# Altium project Closed_Loop_Sensor.PrjPcb
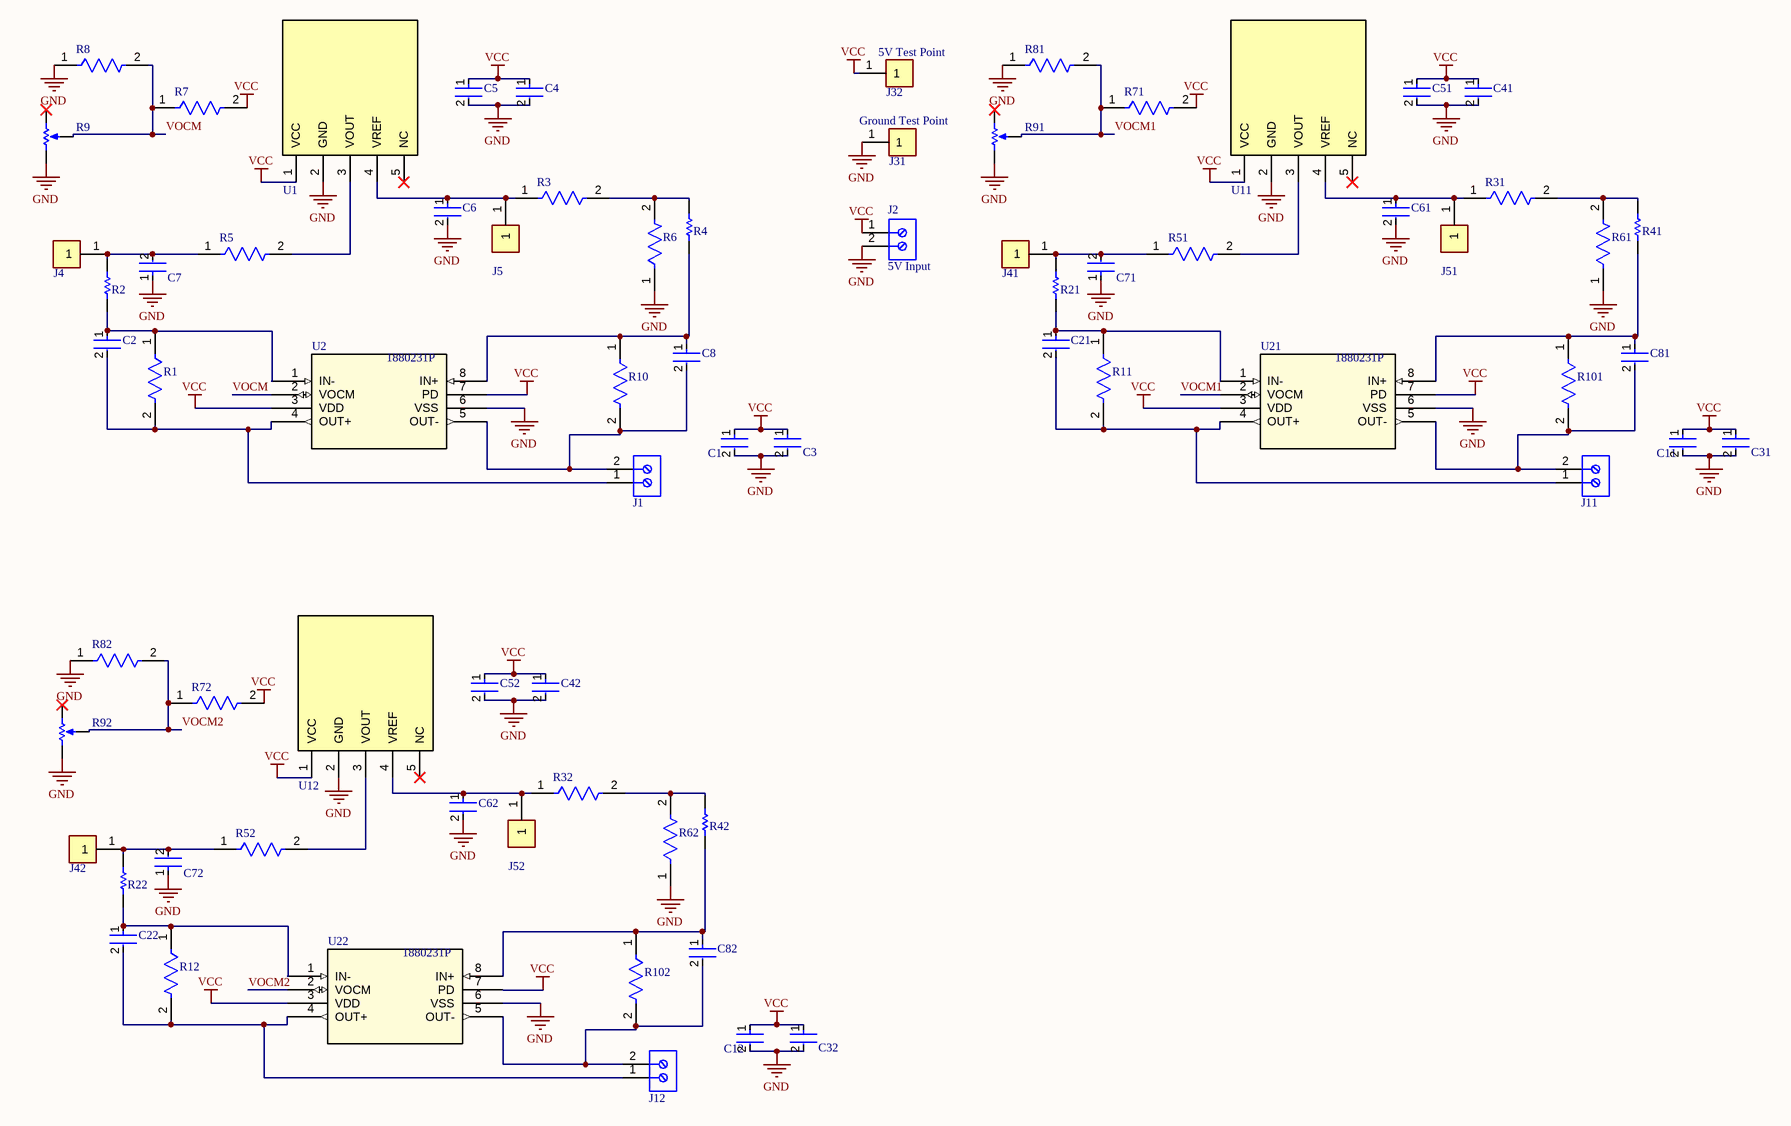
[diagram p0: Sensor.SchDoc]
1 sheet, 72 parts. Net scope: global (net labels, ports and power ports of the same name join across sheets).
Board file: Sensor.PcbDoc

## Sheet Sensor.SchDoc: Closed Loop Sensor
size 420 x 297 mm; ENG_APP_DATE: --/--/--; DSN_APP_DATE: --/--/--; CHK_APP_DATE: --/--/--; DrawnBy: João Chaves; DocumentNumber: 1; SheetNumber: 1; SheetTotal: 1

### Parts
C1  0805YC105KAT2A  [FP-0805-L_2_01_0_2-W_1_25-IPC_A]  (value not drawn)
C2  06035A100JAT2A  [FP-0603-L_1_6_0_15-W_0_81-MFG]  (value not drawn)
C3  CL21B104KACNNNC  [FP-CL21-IPC_C]  (value not drawn)
C4  CL21A106KPFNNNG  [FP-CL21-IPC_B]  (value not drawn)
C5  CL21B104KACNNNC  [FP-CL21-IPC_C]  (value not drawn)
C6  CL21B104KACNNNC  [FP-CL21-IPC_C]  (value not drawn)
C7  06035A100JAT2A  [FP-0603-L_1_6_0_15-W_0_81-MFG]  (value not drawn)
C8  06035A100JAT2A  [FP-0603-L_1_6_0_15-W_0_81-MFG]  (value not drawn)
C11  0805YC105KAT2A  [FP-0805-L_2_01_0_2-W_1_25-IPC_A]  (value not drawn)
C12  0805YC105KAT2A  [FP-0805-L_2_01_0_2-W_1_25-IPC_A]  (value not drawn)
C21  06035A100JAT2A  [FP-0603-L_1_6_0_15-W_0_81-MFG]  (value not drawn)
C22  06035A100JAT2A  [FP-0603-L_1_6_0_15-W_0_81-MFG]  (value not drawn)
C31  CL21B104KACNNNC  [FP-CL21-IPC_C]  (value not drawn)
C32  CL21B104KACNNNC  [FP-CL21-IPC_C]  (value not drawn)
C41  CL21A106KPFNNNG  [FP-CL21-IPC_B]  (value not drawn)
C42  CL21A106KPFNNNG  [FP-CL21-IPC_B]  (value not drawn)
C51  CL21B104KACNNNC  [FP-CL21-IPC_C]  (value not drawn)
C52  CL21B104KACNNNC  [FP-CL21-IPC_C]  (value not drawn)
C61  CL21B104KACNNNC  [FP-CL21-IPC_C]  (value not drawn)
C62  CL21B104KACNNNC  [FP-CL21-IPC_C]  (value not drawn)
C71  06035A100JAT2A  [FP-0603-L_1_6_0_15-W_0_81-MFG]  (value not drawn)
C72  06035A100JAT2A  [FP-0603-L_1_6_0_15-W_0_81-MFG]  (value not drawn)
C81  06035A100JAT2A  [FP-0603-L_1_6_0_15-W_0_81-MFG]  (value not drawn)
C82  06035A100JAT2A  [FP-0603-L_1_6_0_15-W_0_81-MFG]  (value not drawn)
J1  691213510002  [691213510002]  (value not drawn)
J2  5V Input  [691213510002]
J4  5001  [FP-5001-MFG]  (value not drawn)
J5  5001  [FP-5001-MFG]  (value not drawn)
J11  691213510002  [691213510002]  (value not drawn)
J12  691213510002  [691213510002]  (value not drawn)
J31  Ground Test Point  [FP-5001-MFG]
J32  5V Test Point  [FP-5001-MFG]
J41  5001  [FP-5001-MFG]  (value not drawn)
J42  5001  [FP-5001-MFG]  (value not drawn)
J51  5001  [FP-5001-MFG]  (value not drawn)
J52  5001  [FP-5001-MFG]  (value not drawn)
R1  RNCP0805FTD1K00  [FP-RNCP0805-MFG]  (value not drawn)
R2  RK73H2ATTD1331F  [RESC2013X60X30NL20T20]  (value not drawn)
R3  RMCF0805ZT0R00  [FP-RMCF0805-MFG]  (value not drawn)
R4  RK73H2ATTD1331F  [RESC2013X60X30NL20T20]  (value not drawn)
R5  RMCF0805ZT0R00  [FP-RMCF0805-MFG]  (value not drawn)
R6  RMCF0805ZT0R00  [FP-RMCF0805-MFG]  (value not drawn)
R7  RT0805DRE0710KL  [FP-RT0805-MFG]  (value not drawn)
R8  RMCF0805ZT0R00  [FP-RMCF0805-MFG]  (value not drawn)
R9  3296W-1-103LF  [BOUR-3296W]  (value not drawn)
R10  RNCP0805FTD1K00  [FP-RNCP0805-MFG]  (value not drawn)
R11  RNCP0805FTD1K00  [FP-RNCP0805-MFG]  (value not drawn)
R12  RNCP0805FTD1K00  [FP-RNCP0805-MFG]  (value not drawn)
R21  RK73H2ATTD1331F  [RESC2013X60X30NL20T20]  (value not drawn)
R22  RK73H2ATTD1331F  [RESC2013X60X30NL20T20]  (value not drawn)
R31  RMCF0805ZT0R00  [FP-RMCF0805-MFG]  (value not drawn)
R32  RMCF0805ZT0R00  [FP-RMCF0805-MFG]  (value not drawn)
R41  RK73H2ATTD1331F  [RESC2013X60X30NL20T20]  (value not drawn)
R42  RK73H2ATTD1331F  [RESC2013X60X30NL20T20]  (value not drawn)
R51  RMCF0805ZT0R00  [FP-RMCF0805-MFG]  (value not drawn)
R52  RMCF0805ZT0R00  [FP-RMCF0805-MFG]  (value not drawn)
R61  RMCF0805ZT0R00  [FP-RMCF0805-MFG]  (value not drawn)
R62  RMCF0805ZT0R00  [FP-RMCF0805-MFG]  (value not drawn)
R71  RT0805DRE0710KL  [FP-RT0805-MFG]  (value not drawn)
R72  RT0805DRE0710KL  [FP-RT0805-MFG]  (value not drawn)
R81  RMCF0805ZT0R00  [FP-RMCF0805-MFG]  (value not drawn)
R82  RMCF0805ZT0R00  [FP-RMCF0805-MFG]  (value not drawn)
R91  3296W-1-103LF  [BOUR-3296W]  (value not drawn)
R92  3296W-1-103LF  [BOUR-3296W]  (value not drawn)
R101  RNCP0805FTD1K00  [FP-RNCP0805-MFG]  (value not drawn)
R102  RNCP0805FTD1K00  [FP-RNCP0805-MFG]  (value not drawn)
U1  STB-LA/Z  [STB_pad_SMT]  (value not drawn)
U2  Supplier Part Number 1: 1880231P  [MSOP8_MS_MCH]  (hidden comment: MCP6D11-E/MS)
U11  STB-LA/Z  [STB_pad_SMT]  (value not drawn)
U12  STB-LA/Z  [STB_pad_SMT]  (value not drawn)
U21  Supplier Part Number 1: 1880231P  [MSOP8_MS_MCH]  (hidden comment: MCP6D11-E/MS)
U22  Supplier Part Number 1: 1880231P  [MSOP8_MS_MCH]  (hidden comment: MCP6D11-E/MS)

### Nets
GND: C1.2 C3.2 C4.2 C5.2 C6.2 C7.1 C11.2 C12.2 C31.2 C32.2 C41.2 C42.2 C51.2 C52.2 C61.2 C62.2 C71.1 C72.1 J2.2 J31.1 R6.1 R8.1 R9.1(CCW) R61.1 R62.1 R81.1 R82.1 R91.1(CCW) R92.1(CCW) U1.2(GND) U2.6(VSS) U11.2(GND) U12.2(GND) U21.6(VSS) U22.6(VSS)
VCC: C1.1 C3.1 C4.1 C5.1 C11.1 C12.1 C31.1 C32.1 C41.1 C42.1 C51.1 C52.1 J2.1 J32.1 R7.2 R71.2 R72.2 U1.1(VCC) U2.3(VDD) U2.7(PD) U11.1(VCC) U12.1(VCC) U21.3(VDD) U21.7(PD) U22.3(VDD) U22.7(PD)
VOCM: R7.1 R8.2 R9.2(S) U2.2(VOCM)
VOCM1: R71.1 R81.2 R91.2(S) U21.2(VOCM)
VOCM2: R72.1 R82.2 R92.2(S) U22.2(VOCM)
NetC2_1: C2.1 R1.1 R2.1 U2.1(IN-)
NetC2_2: C2.2 J1.1 R1.2 U2.4(OUT+)
NetC6_1: C6.1 J5.1 R3.1 U1.4(VREF)
NetC7_2: C7.2 J4.1 R2.2 R5.1
NetC8_1: C8.1 R4.1 R10.1 U2.8(IN+)
NetC8_2: C8.2 J1.2 R10.2 U2.5(OUT-)
NetC21_1: C21.1 R11.1 R21.1 U21.1(IN-)
NetC21_2: C21.2 J11.1 R11.2 U21.4(OUT+)
NetC22_1: C22.1 R12.1 R22.1 U22.1(IN-)
NetC22_2: C22.2 J12.1 R12.2 U22.4(OUT+)
NetC61_1: C61.1 J51.1 R31.1 U11.4(VREF)
NetC62_1: C62.1 J52.1 R32.1 U12.4(VREF)
NetC71_2: C71.2 J41.1 R21.2 R51.1
NetC72_2: C72.2 J42.1 R22.2 R52.1
NetC81_1: C81.1 R41.1 R101.1 U21.8(IN+)
NetC81_2: C81.2 J11.2 R101.2 U21.5(OUT-)
NetC82_1: C82.1 R42.1 R102.1 U22.8(IN+)
NetC82_2: C82.2 J12.2 R102.2 U22.5(OUT-)
NetR3_2: R3.2 R4.2 R6.2
NetR5_2: R5.2 U1.3(VOUT)
NetR31_2: R31.2 R41.2 R61.2
NetR32_2: R32.2 R42.2 R62.2
NetR51_2: R51.2 U11.3(VOUT)
NetR52_2: R52.2 U12.3(VOUT)

Not connected (* = marked no-connect by the designer): R9 3(CW)*; R91 3(CW)*; R92 3(CW)*; U1 5(NC)*; U11 5(NC)*; U12 5(NC)*

### Notes on the sheet
- THIS DOCUMENT AND THE DATA DISCLOSED HEREIN OR
- HEREWITH IS THE PROPERTY OF ALTIUM LIMITED AND MAY
- DWG NO:
- REVISION
- REV:
- DESCRIPTION
- DATE
- APPROVED
- BE FREELY DISTRIBUTED IN WHOLE. NO RIGHTS ARE
- RESERVED OR EXPRESS OR IMPLIED WARANTEE GIVEN.
- ENG:
- APPROVALS
- PROJECT
- DSN:
- CHK:
- REFERENCE DOCUMENTS
- PROJECT REVISION:
- TITLE
- DOCUMENT REVISION:
- DESIGN ITEM:
- BOM:
- FAB DWG:
- PCB DWG:
- ASSY DWG:
- SCALE:
- A3
- SIZE
- CAGE CODE
- FILE NAME
- DWG NO.
- SHEET
- OF
- REV

### Library data of the parts
C1 C11 C12 = CMP-2007-04655-2: General Purpose Ceramic Capacitor, 0805, 1uF, 10%, X7R, 15%, 16V; Dissipation Factor: 3.5%; Case/Package: 0805; Dielectric Material: Ceramic; Number of Pins: 2; Length: 2.01mm; Tolerance: 10%; Capacitance: 1uF; Depth: 1.25mm; Termination: SMD/SMT; Height: 1.4mm; Packaging: Tape and Reel; Max Operating Temperature: 125°C; Case Code (Imperial): 0805; Lead Free: Lead Free; Package Quantity: 1; Construction: Flat; Voltage Rating (DC): 16V; Radiation Hardening: No; Contact Plating: Tin; Thickness: 0.055inch; Dielectric: X7R; Width: 0.049inch; Voltage: 16V; Voltage Rating: 16V; Mount: Surface Mount; Series: -; Min Operating Temperature: -55°C; REACH SVHC: No SVHC; RoHS Compliant: Yes; Case Code (Metric): 2012
C2 C7 C8 C21 C22 C71 C72 C81 C82 = CMP-2006-04215-2: General Purpose Ceramic Capacitor, 0603, 10pF, 5%, NP0, 30ppm/°C, 50V; Dielectric: C0G; Insulation Resistance: 100GR; Temperature Coefficient: 30ppm/°C; Case/Package: 0603; Tolerance: 5%; Radiation Hardening: No; Contact Plating: Tin; Dielectric Material: Ceramic; Thickness: 0.035inch; Capacitance: 10pF; Depth: 0.81mm; Min Operating Temperature: -55°C; Case Code (Metric): 1608; Max Operating Temperature: 125°C; Package Quantity: 1; Lead Free: Lead Free; Case Code (Imperial): 0603; Termination: SMD/SMT; Voltage Rating (DC): 50V; RoHS Compliant: Yes; REACH SVHC: No SVHC; Width: 0.032inch; Number of Pins: 2; Packaging: Tape and Reel; Height: 0.63mm; Voltage Rating: 50V; Mount: Surface Mount; Length: 1.6mm; Voltage: 50V
C3 C5 C6 C31 C32 C51 C52 C61 C62 = CMP-13271-002854-1: CL21 Series 0805 100nF 25V ±10% Tolerance X7R Multilayer Ceramic Chip Capacitor; Thickness: 0.037inch; Dielectric: X7R; Packaging: Tape and Reel; Height: 0.85mm; Case/Package: 0805; Mount: Surface Mount; Case Code (Imperial): 0805; Capacitance: 100nF; Case Code (Metric): 2012; Length: 2mm; Voltage Rating: 25V; Voltage: 25V; Contact Plating: Tin; Tolerance: 10%; Max Operating Temperature: 125°C; Width: 0.049inch; Min Operating Temperature: -55°C; Radiation Hardening: No; Package Quantity: 1; Depth: 1.25mm
C4 C41 C42 = CMP-13271-001796-1: CL21 Series 0805 10uF 10V ±10% Tolerance X5R Multilayer Ceramic Chip Capacitor; Lead Free: Lead Free; Packaging: Tape and Reel; Capacitance: 10uF; Case Code (Imperial): 0805; Length: 2mm; Thickness: 0.053inch; Depth: 1.25mm; Mount: Surface Mount; Voltage: 10V; Case/Package: 0805; Dielectric: X5R; Height: 1.25mm; Voltage Rating: 10V; Radiation Hardening: No; Tolerance: 10%; Package Quantity: 3000; Min Operating Temperature: -55°C; Case Code (Metric): 2012; Width: 0.049inch; Max Operating Temperature: 85°C; Termination: Wraparound
J1 J2 J11 J12 = CMP-1502-02597-1: Serie 2135 - 5.08 mm Horizontal Entry Modular with Rising Cage Clamp WR-TBL, 2 pin; Manufacturer: Wurth Elektronik; Pin Number: 2; Pitch: 5.08mm; Datasheet URL: http://katalog.we-online.de/em/datasheet/6912135100xx.pdf; Part Number: 691213510002; Publisher: WurthElektronik; Manufacturer URL: http://www.we-online.de; Operating Temperature: -30to120degC; Mounting Technology: THT; Packaging: Box; Package Reference: 691213510002
J4 J5 J31 J32 J41 J42 J51 J52 = CMP-2000-05181-2: PC TEST POINT MINIATURE BLACK; Body Material: Bronze; Plating: Silver; Inside Diameter: 1.27mm; Hole Diameter: 1.6mm; Number of Ports: 1; Outside Diameter: 2.54mm; Insulation: Insulated; Insulation Material: Nylon; Mount: Through Hole; RoHS Compliant: Yes; Series: THM; Height: 0.3inch; Termination: Through Hole; Material: Nylon; Packaging: Bulk; Contact Material: Bronze; REACH SVHC: No SVHC; Contact Plating: Silver; Orientation: Straight; Lead Free: Lead Free; Package Quantity: 100; Length: 7.62mm; Flammability Rating: UL94 V-0; Number of Contacts: 1; Diameter: 2.54mm; Housing Color: Black; Color: Black
R1 R10-R12 R101 R102 = CMP-26527-001902-1: 1kΩ ±1% 0.25W 0805 High Power Anti-Sulfur Thin Film Chip Resistor; Resistance: 1kR; Power Rating: 250mW; Temperature Coefficient: 100ppm/°C; Series: RNCP; RoHS Compliant: Yes; Case Code (Metric): 2012; Length: 0.079inch; Case/Package: 0805; Max Power Dissipation: 250mW; Height: 0.024inch; Size Code: 0805; Max Operating Temperature: 155°C; Tolerance: 1%; Min Operating Temperature: -55°C; Width: 0.049inch; Case Code (Imperial): 0805; Packaging: Tape and Reel; Mount: Surface Mount; Features: Moisture Resistant; Lead Free: Lead Free; Resistor Type: Thin Film; Number of Terminations: 2
R2 R4 R21 R22 R41 R42 = CMP-2001-02064-1: Manufacturer: KOA Speer; Part Number: RK73H2ATTD1331F
R3 R5 R6 R8 R31 R32 R51 R52 R61 R62 R81 R82 = CMP-26527-000017-1: RES 0 OHM JUMPER 1/8W 0805; Power Rating: 125mW; Resistance: 0mR; Depth: 1.25mm; Length: 2mm; Military Standard: Not; Width: 0.049inch; Case Code (Imperial): 0805; Number of Terminations: 2; Mount: Surface Mount; Contact Plating: Tin; Height: 0.026inch; Case/Package: 0805; Min Operating Temperature: -55°C; Composition: Thick Film; Max Operating Temperature: 155°C; Packaging: Tape and Reel; Features: Automotive AEC-Q200; Max Power Dissipation: 125mW; Radiation Hardening: No; Lead Free: Lead Free; Case Code (Metric): 2012
R7 R71 R72 = CMP-2001-01785-2: RES 10.0K OHM 1/8W .5% SMD 0805; Manufacturer: Yageo; Value: 10KΩ; Voltage Rating: 150V; Tolerance: 0.01; Temperature Coefficient: 50 ppm/°C; Power Rating: 0.125W; Series: RT; Device Class L2: Resistors; Ipc Land Pattern Name: RESC200125X50; Manufacturer Part Number: RT0805DRE0710KL; Temperature: -55°C to +155°C; Height: 0.6mm; Composition: Thin Film; Automotive: No; Resistance: 10KΩ; Footprint Url: http://www.yageo.com/exep/pages/download/literatures/PYu-R_Mount_10.pdf; Package: RT0805; Device Class L1: Passive Components; Octopart: https://octopart.com/rt0805dre0710kl-yageo-1180739; Mouser Description: Res Thin Film 0805 10K Ohm 0.5% 1/8W ±50ppm/°C Molded SMD Paper T/R; Temperature Range Low: -55°C; Category: Res; RoHS: TRUE; Device Class L3: Chip SMD Resistors; ComponentLink2Description: Datasheet; Lead Free: Yes; Temperature Range High: +155°C; Digikey Description: RES 10.0K OHM 1/8W .5% SMD 0805; ComponentLink2URL: http://www.yageo.com/documents/recent/PYu-RT_1-to-0.01_RoHS_L_9.pdf
R9 R91 R92 = CMP-1747-00001-1: Square Trimpot(R) Trimming Potentiometer, 10 KOhm, +/- 10%, 0.5 W, -55 to 125 degC, 3-Pin THD, RoHS, Tube; Voltage Rating: 75 V; Resistance: 120 Ohm; Tolerance: 1%; Power Rating: 100 mW; Case\Package: 0603; Type (Resistor): Thick Film; PackageDescription: 3-Pin Through Hole Device, Body 9.53 x 4.83 mm, Pitch 2.54 mm; RoHSCompliant: true; Package Quantity: 5000; Case Code (Metric): 1608; PackageReference: 3296W; ComponentLink2Description: Datasheet; REACH SVHC: Unknown; Case Code (Imperial): 0603; ComponentLink1URL: http://www.bourns.com/; Width: 0.85 mm; Radiation Hardening: No; Min Operating Temperature: -55 degC; Mount: Surface Mount; ComponentLink1Description: Manufacturer URL; Max Operating Temperature: 155 degC; Weight: 7.1E-05 oz; Pins: 2; DatasheetVersion: May-16; Packaging: Tape and Reel; Height: 0.45 mm; Length: 1.55 mm; ComponentLink2URL: http://www.bourns.com/docs/Product-Datasheets/3296.pdf
U2 U21 U22 = MCP6D11-E/MS: No Description Available; Mfr_Name: Microchip; Copyright: Copyright (C) 2022 Ultra Librarian. All rights reserved.; Manufacturer_Part_Number: MCP6D11-E/MS; RefDes: RefDes; Type: DEV; Supplier 1: RSComponents